# EAGLE design zeroserialnano (EAGLE 7.2.0)
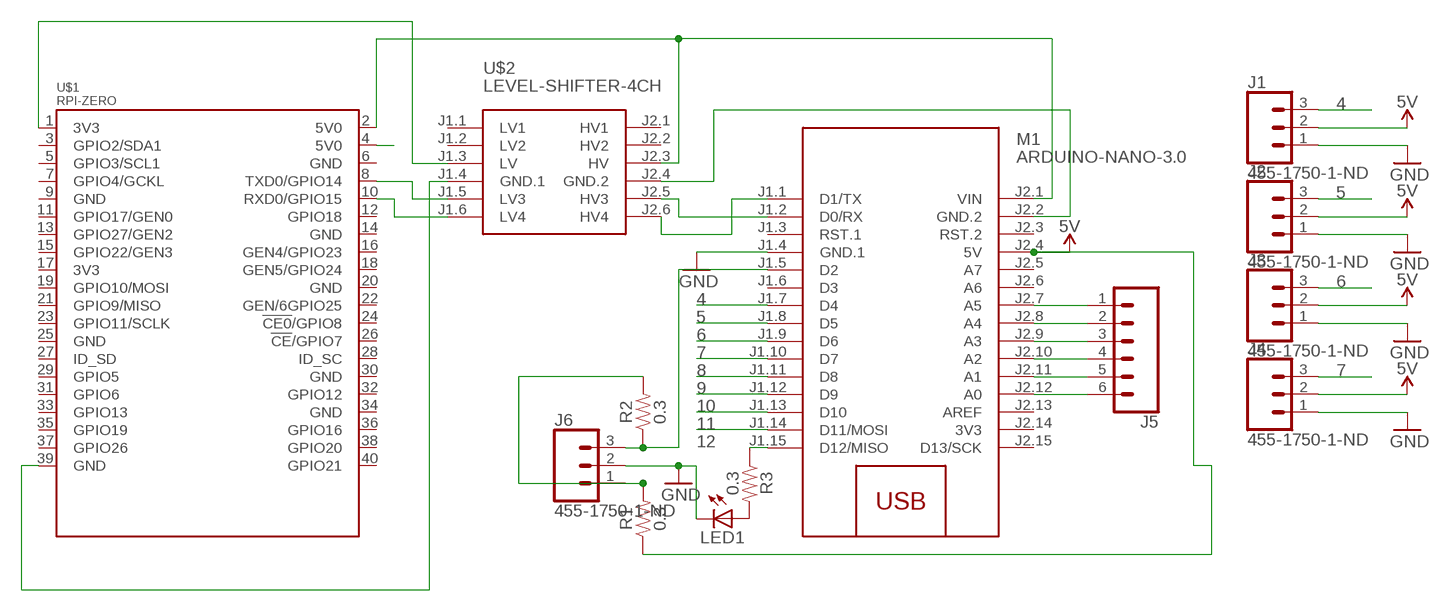
[diagram p0: schematic, sheet 1]

## Parts
J1  455-1750-1-ND  CONN_03  [1X03]
J2  455-1750-1-ND  CONN_03  [1X03]
J3  455-1750-1-ND  CONN_03  [1X03]
J4  455-1750-1-ND  CONN_03  [1X03]
J5  CONN_06NO_SILK_FEMALE_PTH  [1X06_NO_SILK]
J6  455-1750-1-ND  CONN_03  [1X03]
LED1  LED5MM  [LED5MM]
M1  ARDUINO-NANO-3.0  [ARDUINO-NANO-3.0]
R1  0.3  0.3OHM-0805-1/8W-1%  [0805]
R2  0.3  0.3OHM-0805-1/8W-1%  [0805]
R3  0.3  0.3OHM-0805-1/8W-1%  [0805]
U$1  RPI-ZERO  [RASPBERRYPI_BASTELSTUBE_V13_RASPI_BOARD_B+_FULL]
U$2  LEVEL-SHIFTER-4CH  [LEVEL-SHIFTER-4CH]

## Nets
3V3@1: U$1.1(3V3) U$2.J1.3(LV)
4: J1.3 M1.J1.7(D4)
5: J2.3 M1.J1.8(D5)
5V: J1.2 J2.2 J3.2 J4.2 M1.J2.4(5V) R1.1
5V0@1: M1.J2.1(VIN) U$1.2(5V0) U$2.J2.3(HV)
5V0@2: U$1.4(5V0)
6: J3.3 M1.J1.9(D6)
7: J4.3 M1.J1.10(D7)
8: M1.J1.11(D8)
9: M1.J1.12(D9)
10: M1.J1.13(D10)
11: M1.J1.14(D11/MOSI)
12: J6.3 M1.J1.5(D2) R2.1
GND: J1.1 J2.1 J3.1 J4.1 J6.2 LED1.K(C) M1.J1.4(GND.1)
GND@3: U$1.39(GND) U$2.J1.4(GND.1)
N$1: U$1.8(TXD0/GPIO14) U$2.J1.5(LV3)
N$2: U$1.10(RXD0/GPIO15) U$2.J1.6(LV4)
N$3: M1.J1.2(D0/RX) U$2.J2.5(HV3)
N$4: M1.J1.1(D1/TX) U$2.J2.6(HV4)
N$5: M1.J2.2(GND.2) U$2.J2.4(GND.2)
N$6: J5.6 M1.J2.12(A0)
N$7: J5.5 M1.J2.11(A1)
N$8: J5.4 M1.J2.10(A2)
N$9: J5.3 M1.J2.9(A3)
N$10: J5.2 M1.J2.8(A4)
N$11: J5.1 M1.J2.7(A5)
N$12: J6.1 R1.2 R2.2
N$13: LED1.A R3.2
N$14: M1.J1.15(D12/MISO) R3.1
Unconnected: M1.J1.3(RST.1) M1.J1.6(D3) M1.J2.3(RST.2) M1.J2.5(A7) M1.J2.6(A6) M1.J2.13(AREF) M1.J2.15(D13/SCK) U$1.3(GPIO2/SDA1) U$1.5(GPIO3/SCL1) U$1.6(GND) U$1.7(GPIO4/GCKL) U$1.9(GND) U$1.11(GPIO17/GEN0) U$1.12(GPIO18) U$1.13(GPIO27/GEN2) U$1.14(GND) U$1.15(GPIO22/GEN3) U$1.16(GEN4/GPIO23) U$1.17(3V3) U$1.18(GEN5/GPIO24) U$1.19(GPIO10/MOSI) U$1.20(GND) U$1.21(GPIO9/MISO) U$1.22(GEN/6GPIO25) U$1.23(GPIO11/SCLK) U$1.24(!CE0!/GPIO8) U$1.25(GND) U$1.26(!CE!/GPIO7) U$1.27(ID_SD) U$1.28(ID_SC) U$1.29(GPIO5) U$1.30(GND) U$1.31(GPIO6) U$1.32(GPIO12) U$1.33(GPIO13) U$1.34(GND) U$1.35(GPIO19) U$1.36(GPIO16) U$1.37(GPIO26) U$1.38(GPIO20) U$1.40(GPIO21) U$2.J1.1(LV1) U$2.J1.2(LV2) U$2.J2.1(HV1) U$2.J2.2(HV2)

## Power pins joined to a net without a drawn wire
3V3: M1.J2.14(3V3)

## Library data of the parts
J1-J4 J6 = SparkFun-Connectors:CONN_03: Multi connection point. Often used as Generic Header-pin footprint for 0.1 inch spaced/style header connections On any of the 0.1 inch spaced packages, you can populate with these: Break Away Headers - Straight <https://www.sparkfun.com/products/116> (PRT-00116) Break Away Male Headers - Right Angle <https://www.sparkfun.com/products/553> (PRT-00553) Female Headers <https://www.sparkfun.com/products/115> (PRT-00115) Break Away Headers - Machine Pin <https://www.sparkfun.com/products/117> (PRT-00117) Break Away Female Headers - Swiss Machine Pin <https://www.sparkfun.com/products/743> (PRT-00743) Stackable Header - 3 Pin (Female, 0.1") <https://www.sparkfun.com/products/13875> (PRT-13875) For SCREWTERMINALS and SPRING TERMINALS visit here: Screw Terimnals on SparkFun.com <https://www.sparkfun.com/search/results?term=Screw+Terminals> (5mm/3.5mm/2.54mm spacing) This device is also useful as a general connection point to wire up your design to another part of your project. Our various solder wires solder well into these plated through hole pads. Hook-Up Wire - Assortment (Stranded, 22 AWG) <https://www.sparkfun.com/products/11375> (PRT-11375) Hook-Up Wire - Assortment (Solid Core, 22 AWG) <https://www.sparkfun.com/products/11367> (PRT-11367) View the entire wire category on our website here <https://www.sparkfun.com/categories/141> Special notes: Molex polarized connector foot print use with SKU : PRT-08232 with associated crimp pins and housings.; PROD_ID: XXX-00000
J5 = SparkFun-Connectors:CONN_06: Multi connection point. Often used as Generic Header-pin footprint for 0.1 inch spaced/style header connections On any of the 0.1 inch spaced packages, you can populate with these: Break Away Headers - Straight <https://www.sparkfun.com/products/116> (PRT-00116) Break Away Male Headers - Right Angle <https://www.sparkfun.com/products/553> (PRT-00553) Female Headers <https://www.sparkfun.com/products/115> (PRT-00115) Break Away Headers - Machine Pin <https://www.sparkfun.com/products/117> (PRT-00117) Break Away Female Headers - Swiss Machine Pin <https://www.sparkfun.com/products/743> (PRT-00743) Arduino Stackable Header - 6 Pin <https://www.sparkfun.com/products/9280> (PRT-09280) For SCREWTERMINALS and SPRING TERMINALS visit here: Screw Terimnals on SparkFun.com <https://www.sparkfun.com/search/results?term=Screw+Terminals> (5mm/3.5mm/2.54mm spacing) This device is also useful as a general connection point to wire up your design to another part of your project. Our various solder wires solder well into these plated through hole pads. Hook-Up Wire - Assortment (Stranded, 22 AWG) <https://www.sparkfun.com/products/11375> (PRT-11375) Hook-Up Wire - Assortment (Solid Core, 22 AWG) <https://www.sparkfun.com/products/11367> (PRT-11367) View the entire wire category on our website here <https://www.sparkfun.com/categories/141>; PROD_ID: CONN-08437
LED1 = led:LED: LED OSRAM: - CHIPLED LG R971, LG N971, LY N971, LG Q971, LY Q971, LO R971, LY R971 LH N974, LH R974 LS Q976, LO Q976, LY Q976 LO Q996 - Hyper CHIPLED LW Q18S LB Q993, LB Q99A, LB R99A - SideLED LS A670, LO A670, LY A670, LG A670, LP A670 LB A673, LV A673, LT A673, LW A673 LH A674 LY A675 LS A676, LA A676, LO A676, LY A676, LW A676 LS A679, LY A679, LG A679 - Hyper Micro SIDELED® LS Y876, LA Y876, LO Y876, LY Y876 LT Y87S - SmartLED LW L88C, LW L88S LB L89C, LB L89S, LG L890 LS L89K, LO L89K, LY L89K LS L896, LA L896, LO L896, LY L896 - TOPLED LS T670, LO T670, LY T670, LG T670, LP T670 LSG T670, LSP T670, LSY T670, LOP T670, LYG T670 LG T671, LOG T671, LSG T671 LB T673, LV T673, LT T673, LW T673 LH T674 LS T676, LA T676, LO T676, LY T676, LB T676, LH T676, LSB T676, LW T676 LB T67C, LV T67C, LT T67C, LS T67K, LO T67K, LY T67K, LW E67C LS E67B, LA E67B, LO E67B, LY E67B, LB E67C, LV E67C, LT E67C LW T67C LS T679, LY T679, LG T679 LS T770, LO T770, LY T770, LG T770, LP T770 LB T773, LV T773, LT T773, LW T773 LH T774 LS E675, LA E675, LY E675, LS T675 LS T776, LA T776, LO T776, LY T776, LB T776 LHGB T686 LT T68C, LB T68C - Hyper Mini TOPLED® LB M676 - Mini TOPLED Santana® LG M470 LS M47K, LO M47K, LY M47K Source: http://www.osram.convergy.de LUXEON: - LUMILED® LXK2-PW12-R00, LXK2-PW12-S00, LXK2-PW14-U00, LXK2-PW14-V00 LXK2-PM12-R00, LXK2-PM12-S00, LXK2-PM14-U00 LXK2-PE12-Q00, LXK2-PE12-R00, LXK2-PE12-S00, LXK2-PE14-T00, LXK2-PE14-U00 LXK2-PB12-K00, LXK2-PB12-L00, LXK2-PB12-M00, LXK2-PB14-N00, LXK2-PB14-P00, LXK2-PB14-Q00 LXK2-PR12-L00, LXK2-PR12-M00, LXK2-PR14-Q00, LXK2-PR14-R00 LXK2-PD12-Q00, LXK2-PD12-R00, LXK2-PD12-S00 LXK2-PH12-R00, LXK2-PH12-S00 LXK2-PL12-P00, LXK2-PL12-Q00, LXK2-PL12-R00 Source: www.luxeon.com KINGBRIGHT: KA-3528ASYC Source: www.kingbright.com
M1 = diy-modules:ARDUINO-NANO-3.0: Arduino Nano 3.0 and compatible devices More details available here: https://www.arduino.cc/en/Main/ArduinoBoardNano Click here to find device on ebay.com <http://www.ebay.com/sch/arduino+nano>
R1-R3 = SparkFun-Resistors:0.3OHM: 0.3Ω resistor A resistor is a passive two-terminal electrical component that implements electrical resistance as a circuit element. Resistors act to reduce current flow, and, at the same time, act to lower voltage levels within circuits. - Wikipedia; PROD_ID: RES-11622
U$1 = RPI-Zero:RPI-ZERO
U$2 = diy-modules:LEVEL-SHIFTER-4CH: 4-Channel Bi-Directional Logic Level Converter based on BSS128 transistors Click here to find device on ebay.com <http://www.ebay.com/sch/i2c+logic+converter+module>

## Board
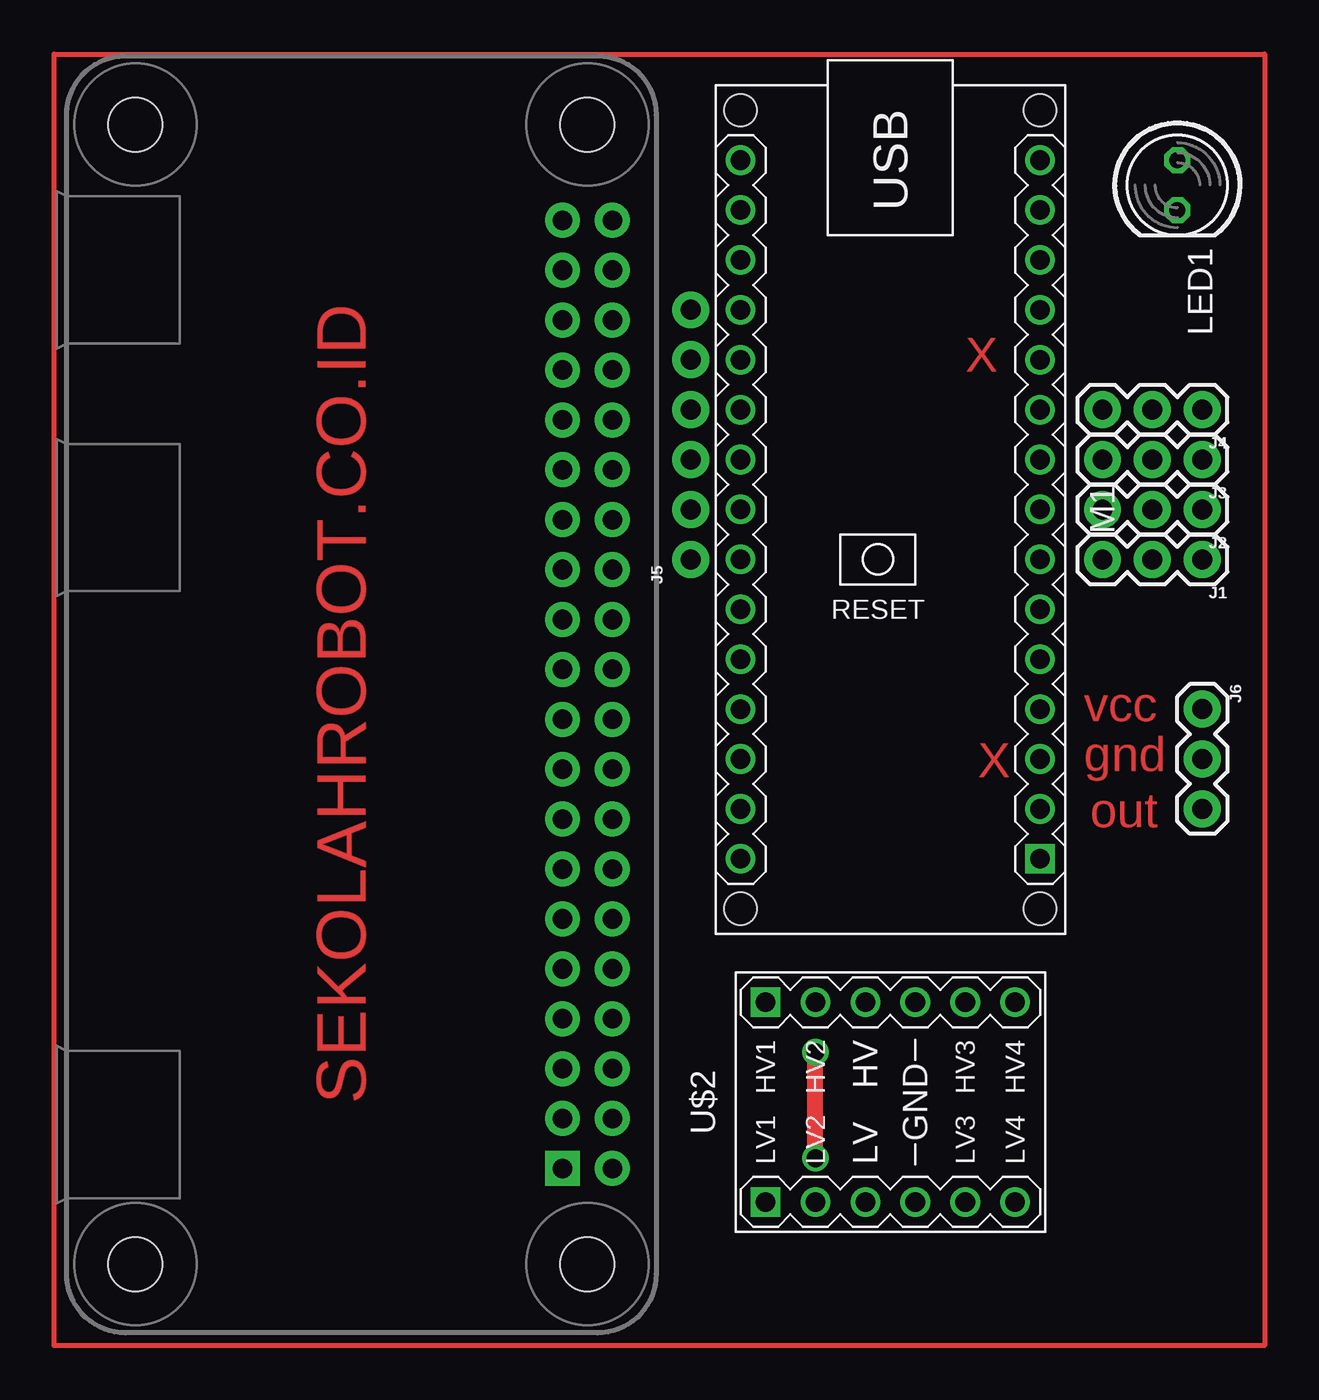
[diagram p1: board, top side]
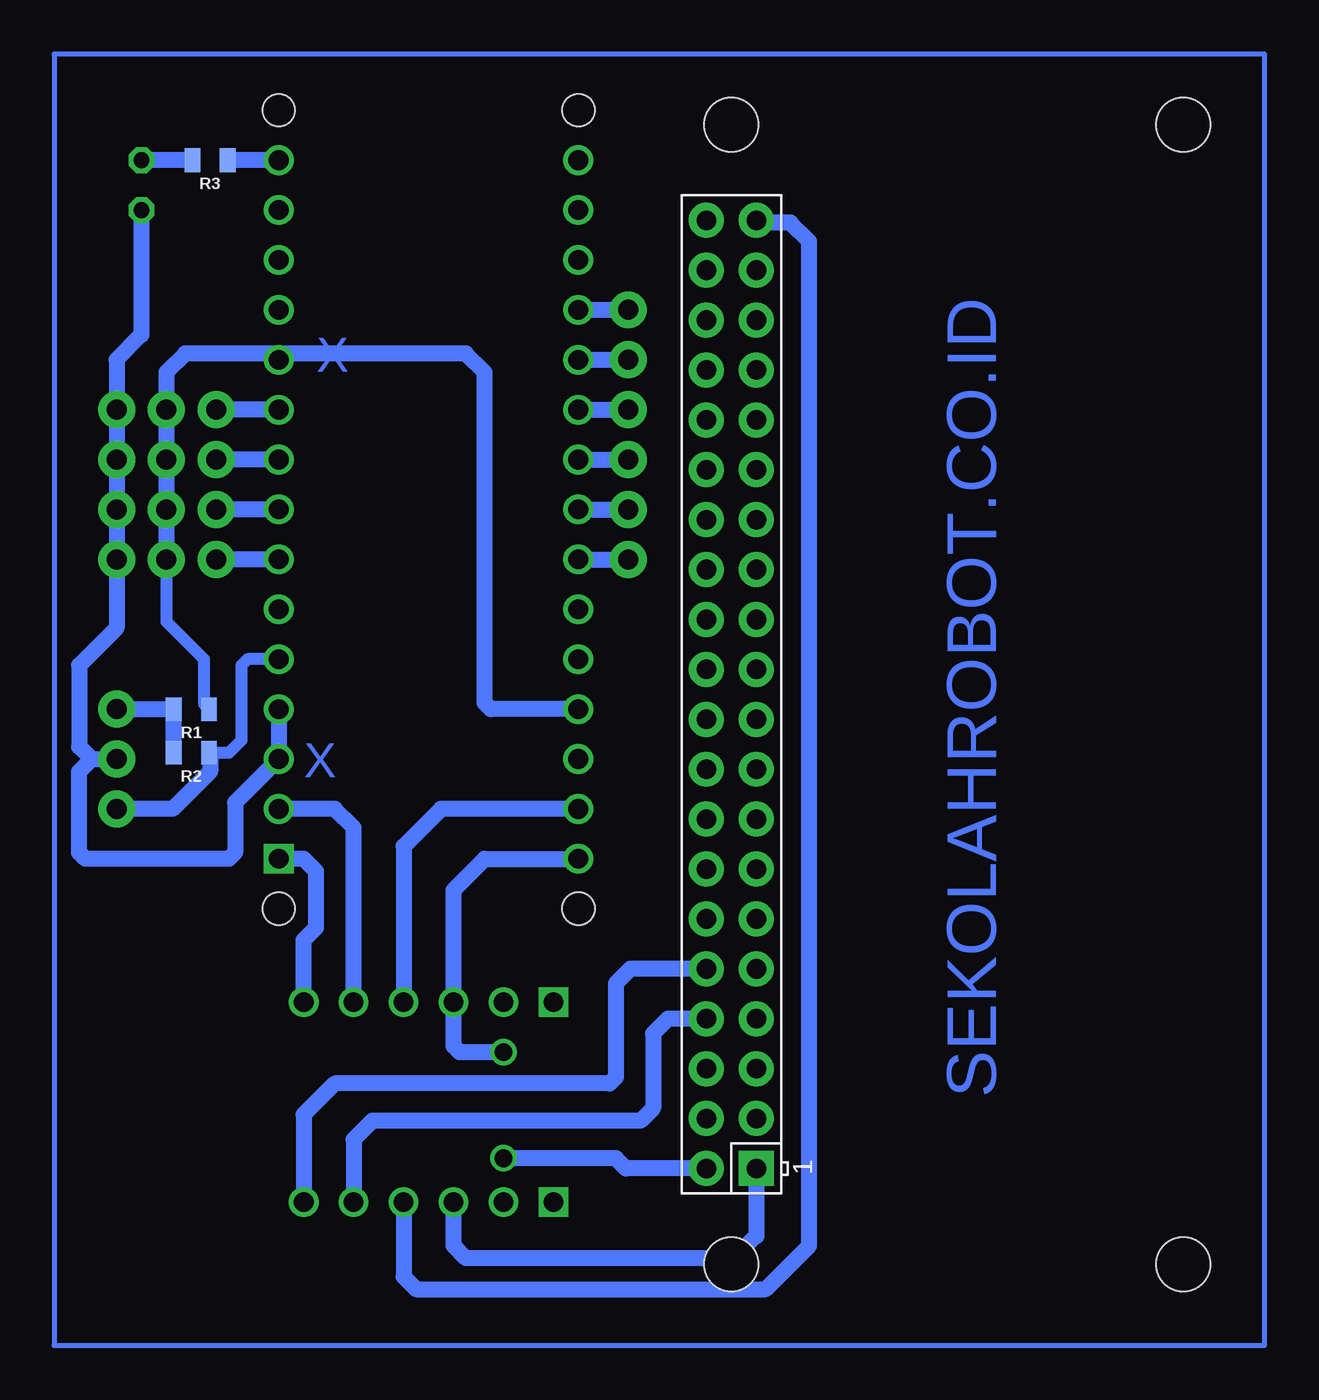
[diagram p2: board, bottom side, seen from below]

No outline drawn. Coordinates in mm, seen from the top.
Copper layers (1*16): Top 0.035mm / dielectric 1.5mm / Bottom 0.035mm
Design rules "default": minimum track width 10mil, minimum drill 24mil, track to track 8mil, track to pad 8mil, pad to pad 8mil, via to via 8mil, smd to smd 8mil, copper to edge 40mil, drill to drill 8mil, minimum pad ring 10mil, minimum via ring 8mil, stop-mask expansion 4mil, vias tented up to drill 0mil, thermal gap 10mil

### Footprints (pad centres in the part's own frame; a part is rotated, then mirrored left to right if it is on the bottom)
1X03 = drill 1.016 pad 1.88: 1 0,0; 2 2.54,0; 3 5.08,0
1X06_NO_SILK = drill 1.016 pad 1.88: 1 0,0; 2 2.54,0; 3 5.08,0; 4 7.62,0; 5 10.16,0; 6 12.7,0
LED5MM = drill 0.813 octagon: A -1.27,0; K 1.27,0
ARDUINO-NANO-3.0 = drill 1 square: J1.1 17.78,7.62 | drill 1: J1.2 15.24,7.62; J1.3 12.7,7.62; J1.4 10.16,7.62; J1.5 7.62,7.62; J1.6 5.08,7.62; J1.7 2.54,7.62; J1.8 0,7.62; J1.9 -2.54,7.62; J1.10 -5.08,7.62; J1.11 -7.62,7.62; J1.12 -10.16,7.62; J1.13 -12.7,7.62; J1.14 -15.24,7.62; J1.15 -17.78,7.62; J2.1 17.78,-7.62; J2.2 15.24,-7.62; J2.3 12.7,-7.62; J2.4 10.16,-7.62; J2.5 7.62,-7.62; J2.6 5.08,-7.62; J2.7 2.54,-7.62; J2.8 0,-7.62; J2.9 -2.54,-7.62; J2.10 -5.08,-7.62; J2.11 -7.62,-7.62; J2.12 -10.16,-7.62; J2.13 -12.7,-7.62; J2.14 -15.24,-7.62; J2.15 -17.78,-7.62 | hole 1.651: -20.32,7.62; -20.32,-7.62; 20.32,-7.62; 20.32,7.62
0805 = smd 0.8 x 1.2: 1 -0.9,0; 2 0.9,0
RASPBERRYPI_BASTELSTUBE_V13_RASPI_BOARD_B+_FULL = drill 1 pad 1.778 square: 1 8.37,25.23 | drill 1 pad 1.778: 2 8.37,27.77; 3 10.91,25.23; 4 10.91,27.77; 5 13.45,25.23; 6 13.45,27.77; 7 15.99,25.23; 8 15.99,27.77; 9 18.53,25.23; 10 18.53,27.77; 11 21.07,25.23; 12 21.07,27.77; 13 23.61,25.23; 14 23.61,27.77; 15 26.15,25.23; 16 26.15,27.77; 17 28.69,25.23; 18 28.69,27.77; 19 31.23,25.23; 20 31.23,27.77; 21 33.77,25.23; 22 33.77,27.77; 23 36.31,25.23; 24 36.31,27.77; 25 38.85,25.23; 26 38.85,27.77; 27 41.39,25.23; 28 41.39,27.77; 29 43.93,25.23; 30 43.93,27.77; 31 46.47,25.23; 32 46.47,27.77; 33 49.01,25.23; 34 49.01,27.77; 35 51.55,25.23; 36 51.55,27.77; 37 54.09,25.23; 38 54.09,27.77; 39 56.63,25.23; 40 56.63,27.77 | hole 2.75: 3.5,3.5; 3.5,26.5; 61.5,3.5; 61.5,26.5
LEVEL-SHIFTER-4CH = drill 1 square: J1.1 -5.08,6.35; J2.1 5.08,6.35 | drill 1: J1.2 -5.08,3.81; J1.3 -5.08,1.27; J1.4 -5.08,-1.27; J1.5 -5.08,-3.81; J1.6 -5.08,-6.35; J2.2 5.08,3.81; J2.3 5.08,1.27; J2.4 5.08,-1.27; J2.5 5.08,-3.81; J2.6 5.08,-6.35

### Placement (x,y rotation side)
J1  65.41,68.58 180 top
J2  65.41,71.12 180 top
J3  65.41,73.66 180 top
J4  65.41,76.2 180 top
J5  39.37,68.58 90 top
J6  65.41,60.96 270 top
LED1  64.14,87.63 270 top
M1  49.53,71.12 270 top
R1  61.59,60.96 180 bottom
R2  61.59,58.74 180 bottom
R3  60.64,88.9 180 bottom
U$1  7.62,29.21 90 bottom
U$2  49.53,40.96 90 top

### Tracks (layer width: path | path; a pad name or v marks a point on that pad's centre or on a via)
3V3@1
  Bottom 0.813: U$1.1 32.85,34.14 33.97,33.02 47.62,33.02 48.26,33.66 U$2.J1.3
4
  Bottom 0.813: M1.J1.7 J1.3
5
  Bottom 0.813: M1.J1.8 J2.3
5V
  Bottom 0.61: J1.2 62.87,65.41 60.96,63.5 60.96,61.23 R1.1
  Bottom 0.813: J1.2 J2.2 J3.2 J4.2 62.87,78.11 61.91,79.06 47.62,79.06 46.67,78.11 46.67,61.28 46.35,60.96 M1.J2.4
5V0@1  (via drill 0.9 pad 1.27)
  Top 0.813: v45.72,38.1 v45.72,43.5
  Bottom 0.813: U$1.2 39.48,37.58 40.01,38.1 v45.72,38.1 | v45.72,43.5 47.94,43.5 48.26,43.81 U$2.J2.3 48.26,51.75 46.67,53.34 M1.J2.1
6
  Bottom 0.813: M1.J1.9 J3.3
7
  Bottom 0.813: M1.J1.10 J4.3
12
  Bottom 0.61: M1.J1.5 58.74,63.5 59.05,63.18 59.05,59.37 59.69,58.74 R2.1
  Bottom 0.813: R2.1 60.64,58.69 60.64,57.78 62.55,55.88 J6.3
GND
  Bottom 0.813: 66.67,58.42 67.31,59.05 67.31,63.18 65.41,65.09 J1.1 J2.1 J3.1 J4.1 65.41,78.74 64.14,80.01 LED1.K | 66.67,58.42 J6.2 | M1.J1.4 57.15,58.42 59.37,56.2 59.37,53.66 59.69,53.34 66.99,53.34 67.31,53.66 67.31,57.78 66.67,58.42
GND@3
  Bottom 0.813: U$2.J1.4 50.8,32.07 50.16,31.43 32.38,31.43 30.16,33.66 30.16,84.77 31.11,85.72 32.73,85.72 U$1.39
N$1
  Bottom 0.813: U$2.J1.5 53.34,39.05 52.39,40.01 38.73,40.01 38.1,40.64 38.1,44.45 37.35,45.2 U$1.8
N$2
  Bottom 0.813: U$2.J1.6 55.88,40.32 54.29,41.91 40.32,41.91 40.01,42.23 40.01,46.99 39.26,47.74 U$1.10
N$3
  Bottom 0.813: U$2.J2.5 53.34,54.93 54.29,55.88 M1.J1.2
N$4
  Bottom 0.813: U$2.J2.6 55.88,49.21 55.24,49.85 55.24,52.7 55.88,53.34 M1.J1.1
N$5
  Bottom 0.813: M1.J2.2 48.9,55.88 50.8,53.98 U$2.J2.4
N$6
  Bottom 0.813: M1.J2.12 J5.6
N$7
  Bottom 0.813: M1.J2.11 J5.5
N$8
  Bottom 0.813: M1.J2.10 J5.4
N$9
  Bottom 0.813: M1.J2.9 J5.3
N$10
  Bottom 0.813: M1.J2.8 J5.2
N$11
  Bottom 0.813: M1.J2.7 J5.1
N$12
  Bottom 0.813: J6.1 R1.2 R2.2
N$13
  Bottom 0.813: R3.2 LED1.A
N$14
  Bottom 0.813: M1.J1.15 R3.1
N$15
  Top 0.254: 6.99,94.3 68.58,94.3 68.58,28.57 6.99,28.57 6.99,94.3
N$16
  Bottom 0.254: 6.99,94.3 68.58,94.3 68.58,28.57 6.99,28.57 6.99,94.3

### Text on the board
Top: SEKOLAHROBOT.CO.ID | X | vcc | gnd | X | out
Bottom: SEKOLAHROBOT.CO.ID | X | X